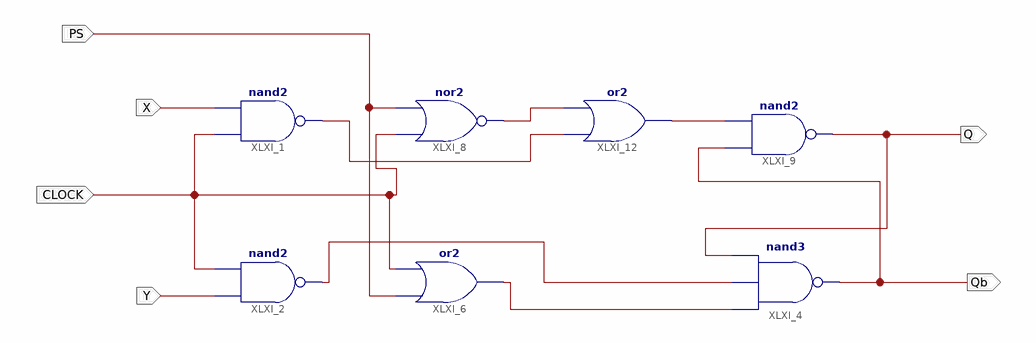
[diagram p0: schematic sheet 1]
// Xilinx ISE schematic SR_Latch_Syn.sch (artix7) as structural Verilog: 7 symbols, 6 ports
module SR_Latch_Syn (
  input  PS,
  input  X,
  input  Y,
  input  CLOCK,
  output Q,
  output Qb
);

  wire XLXN_9, XLXN_11, XLXN_27, XLXN_28, XLXN_29;

  nand XLXI_1 (XLXN_27, CLOCK, X);
  nand XLXI_2 (XLXN_9, Y, CLOCK);
  nand XLXI_4 (Qb, XLXN_11, XLXN_9, Q);
  or XLXI_6 (XLXN_11, PS, CLOCK);
  nor XLXI_8 (XLXN_28, CLOCK, PS);
  nand XLXI_9 (Q, Qb, XLXN_29);
  or XLXI_12 (XLXN_29, XLXN_27, XLXN_28);
endmodule
